# EAGLE design ETH_module (EAGLE 7.2.0)
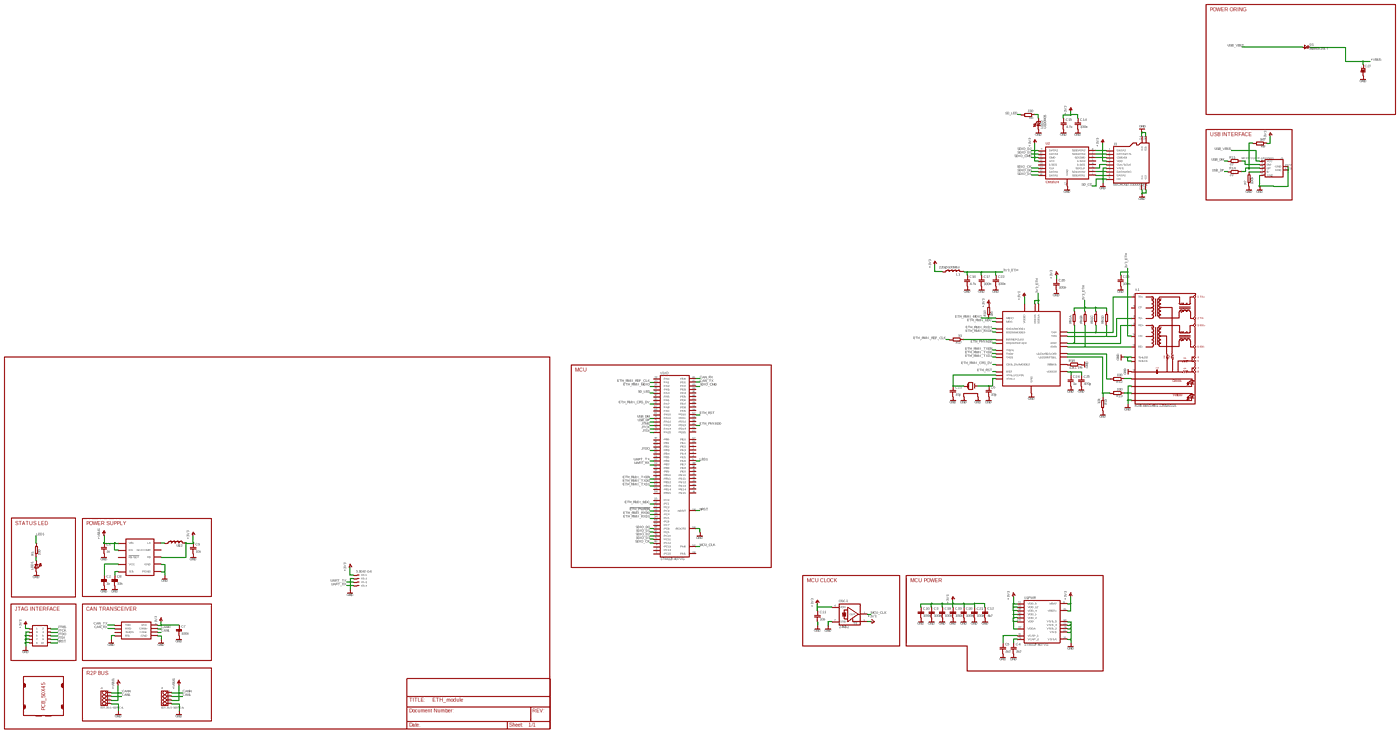
[diagram p0: schematic, sheet 1, overview]
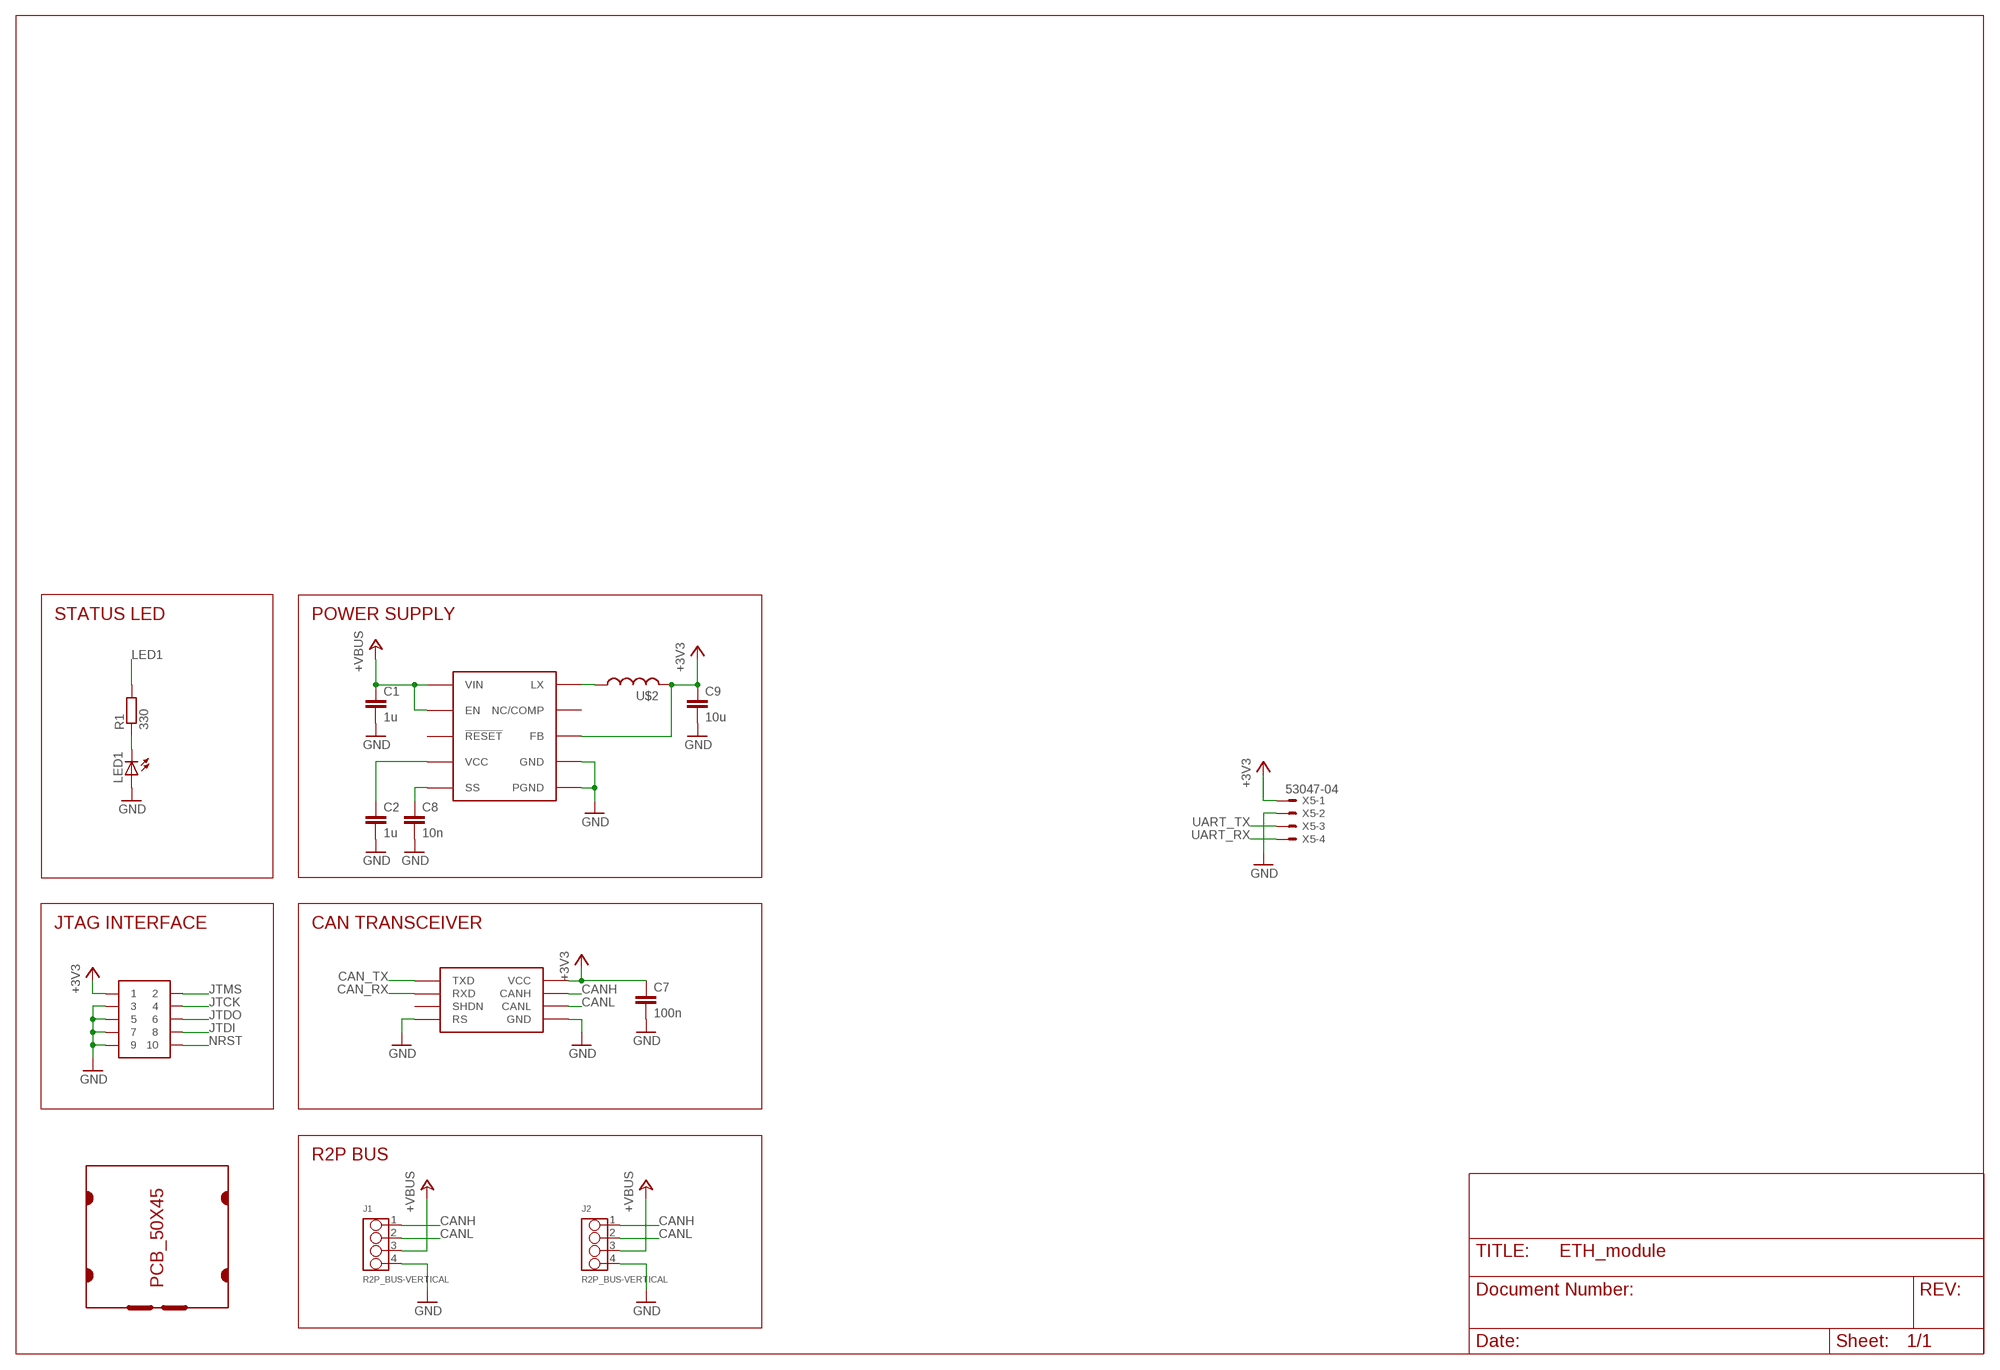
[diagram p1: schematic, sheet 1, part 1 of 4]
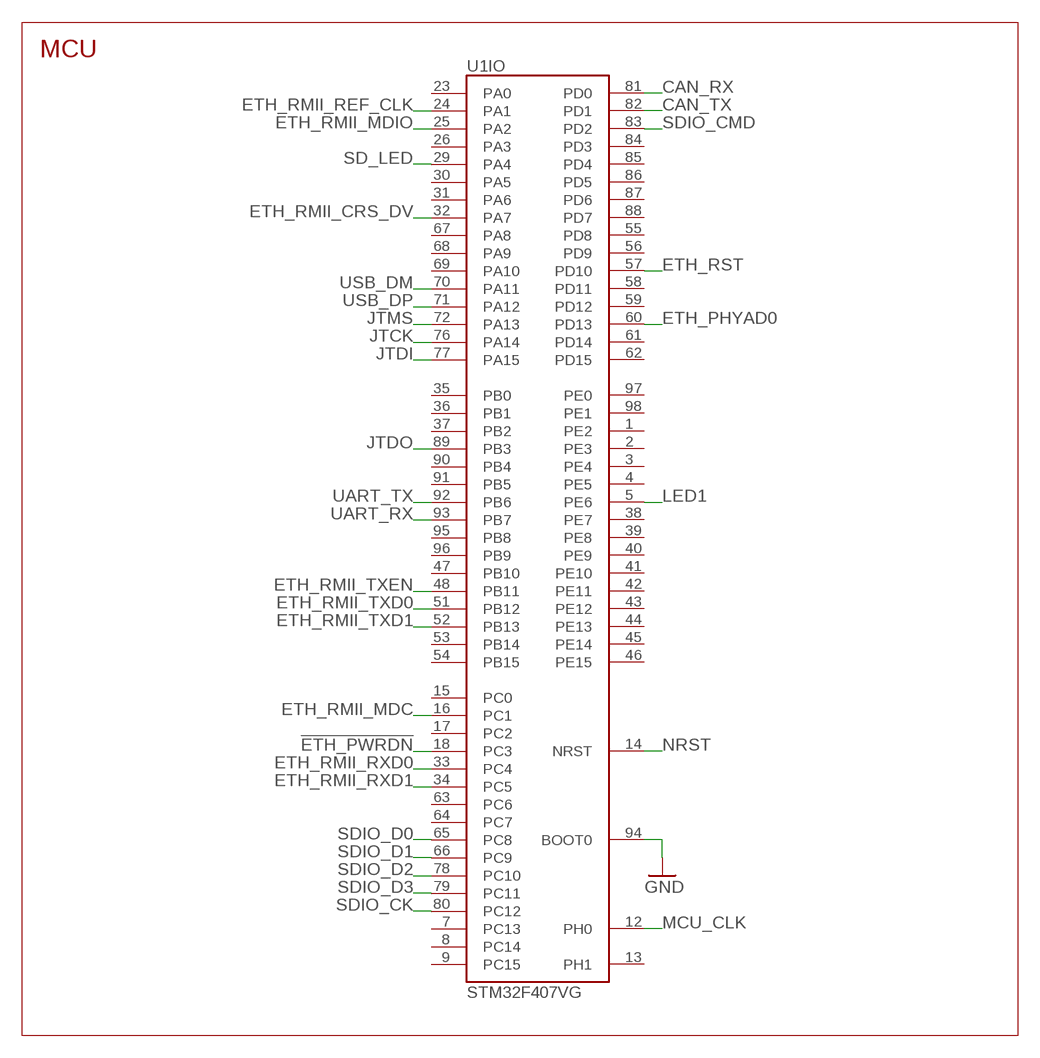
[diagram p2: schematic, sheet 1, part 2 of 4]
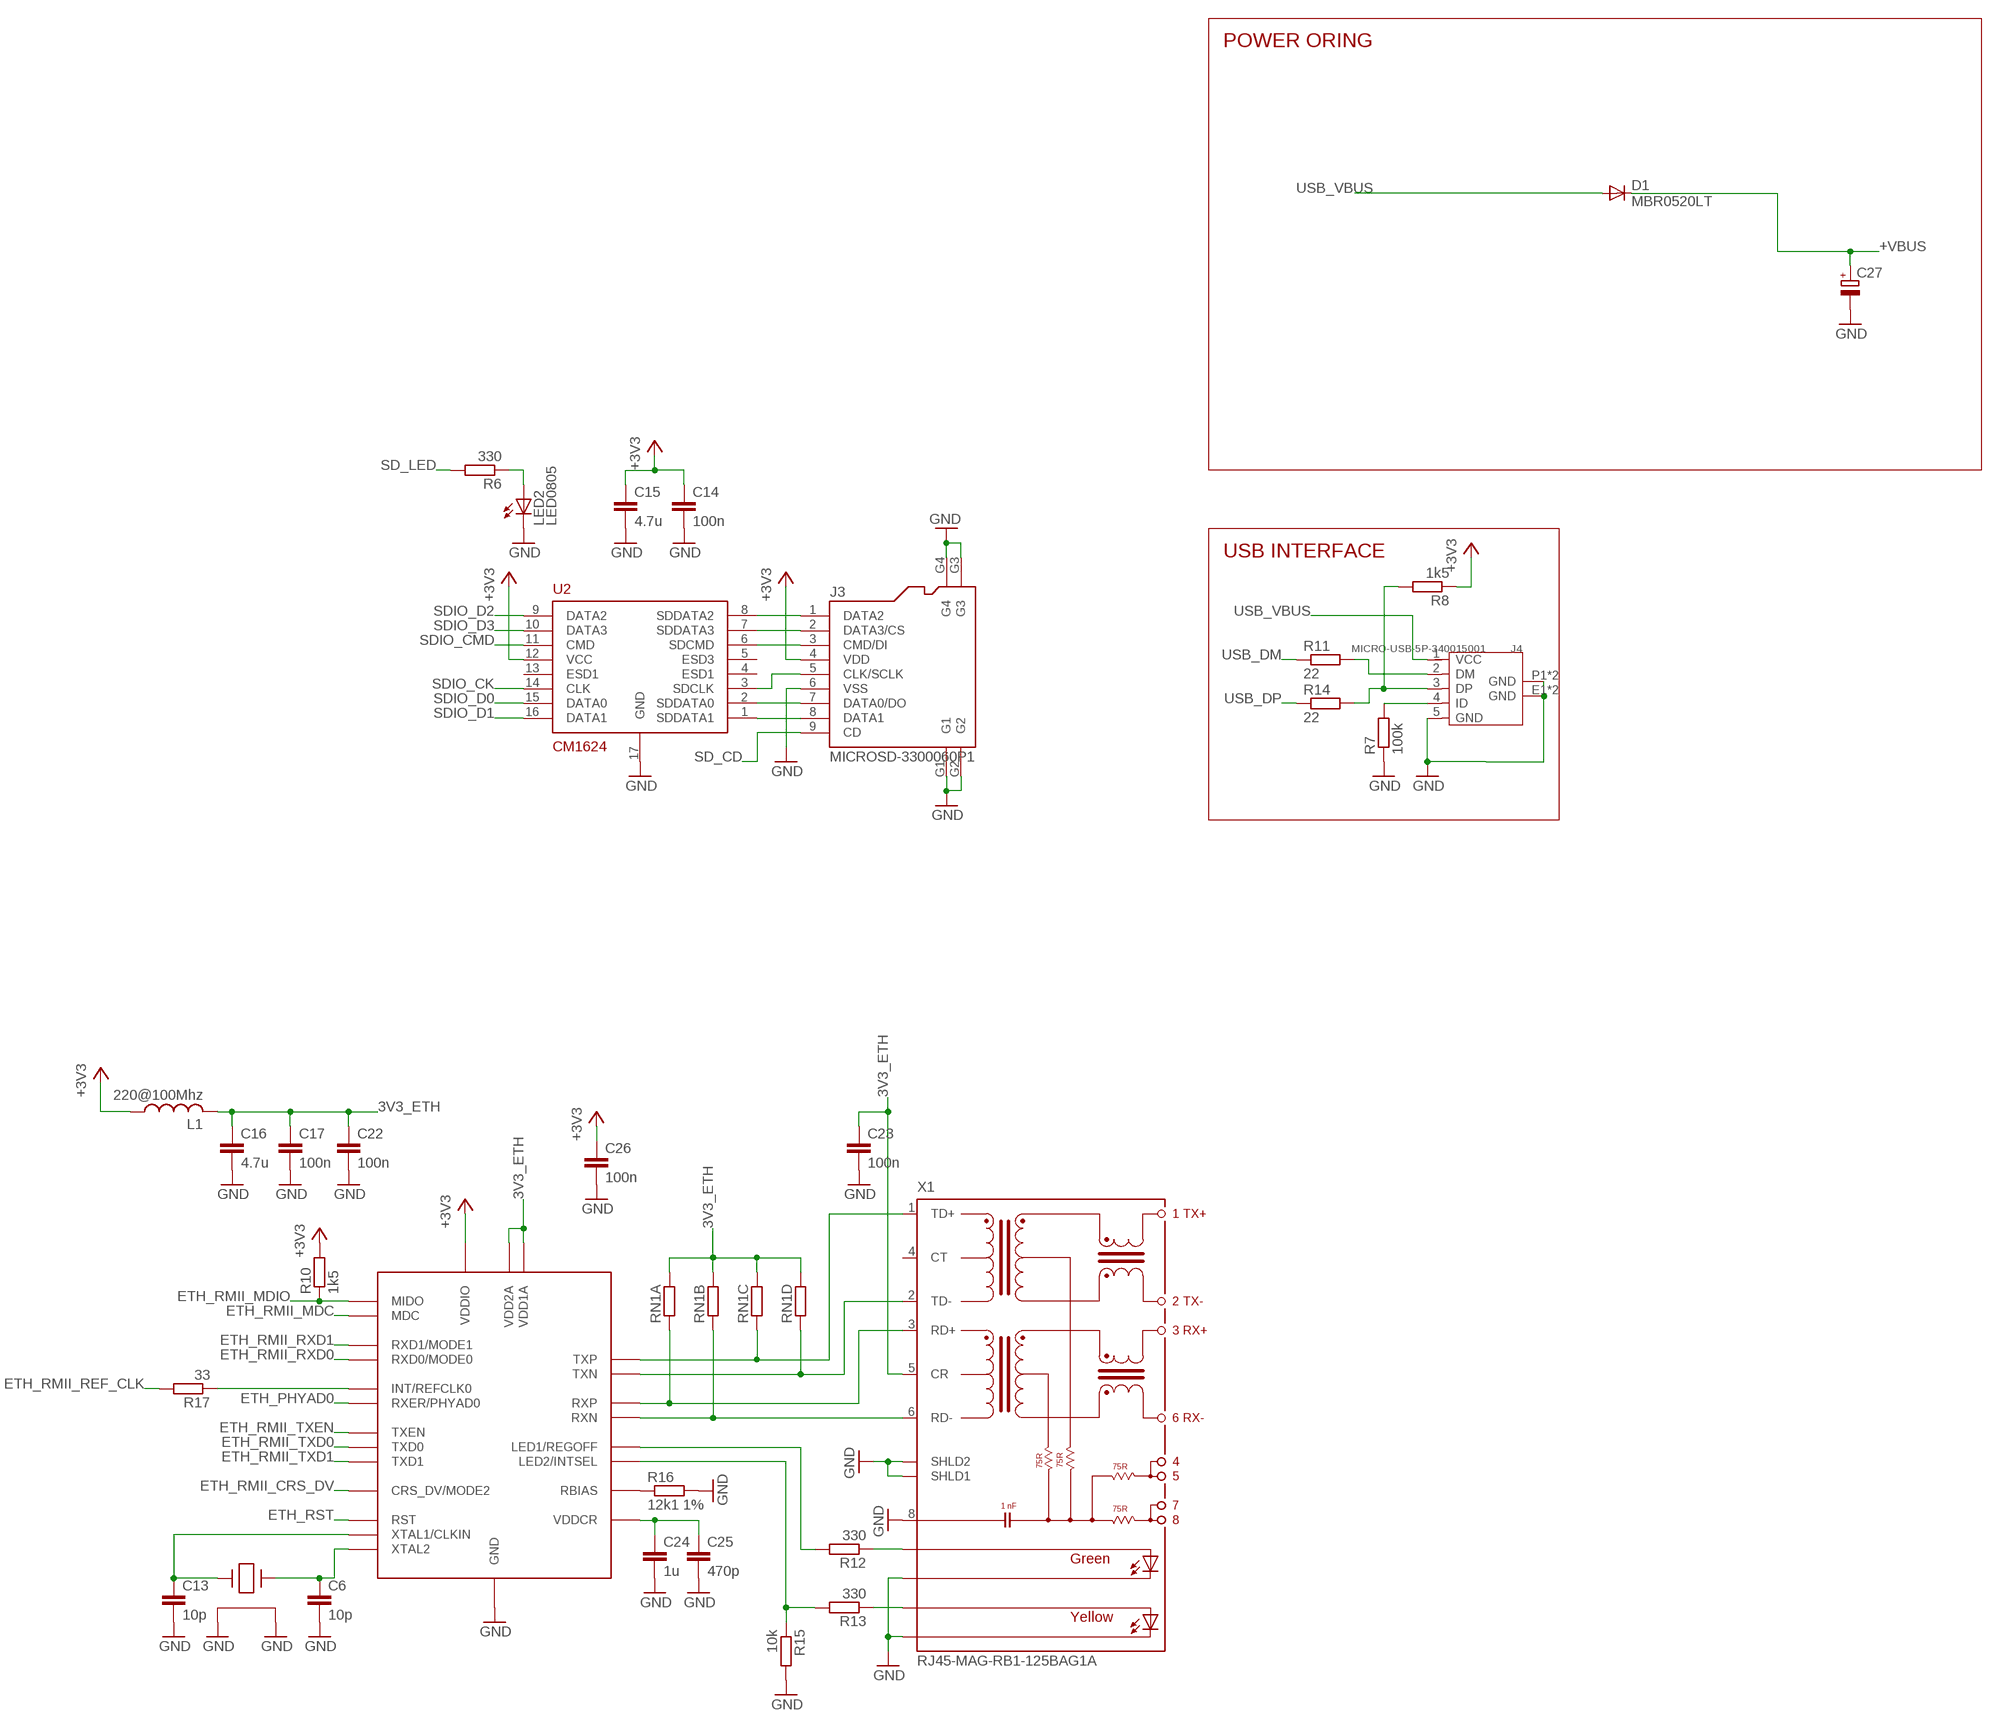
[diagram p3: schematic, sheet 1, part 3 of 4]
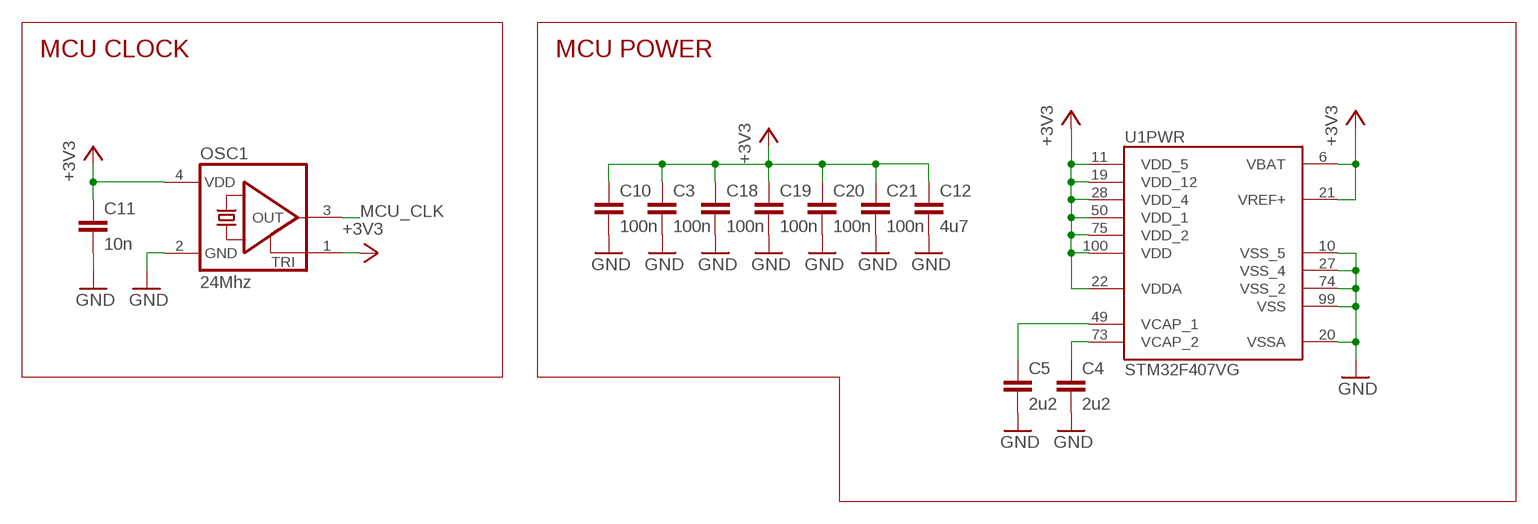
[diagram p4: schematic, sheet 1, part 4 of 4]

## Parts
C1  1u  C1206  [C1206]
C2  1u  C0603  [C0603]
C3  100n  C0603  [C0603]
C4  2u2  C0603  [C0603]
C5  2u2  C0603  [C0603]
C6  10p  C0603  [C0603]
C7  100n  C0603  [C0603]
C8  10n  C0603  [C0603]
C9  10u  C0805  [C0805]
C10  100n  C0603  [C0603]
C11  10n  C0603  [C0603]
C12  4u7  C0805  [C0805]
C13  10p  C0603  [C0603]
C14  100n  C0603  [C0603]
C15  4.7u  C0805  [C0805]
C16  4.7u  C0805  [C0805]
C17  100n  C0603  [C0603]
C18  100n  C0603  [C0603]
C19  100n  C0603  [C0603]
C20  100n  C0603  [C0603]
C21  100n  C0603  [C0603]
C22  100n  C0603  [C0603]
C23  100n  C0603  [C0603]
C24  1u  C0603  [C0603]
C25  470p  C0603  [C0603]
C26  100n  C0603  [C0603]
C27  CPOL-EUB/3528-21R  [B/3528-21R]
D1  MBR0520LT  [SOD123]
J1  R2P_BUS-VERTICAL  [OPL-EAGLE-LIBRARY_4P-2.0]
J2  R2P_BUS-VERTICAL  [OPL-EAGLE-LIBRARY_4P-2.0]
J3  MICROSD-3300060P1  [9P-SMD-W-RING]
J4  MICRO-USB-5P-340015001  [B-SMD-5P]
L1  220@100Mhz  L0603  [L0603]
LED1  LED0805  [CHIPLED_0805]
LED2  LED0805  [CHIPLED_0805]
OSC1  24Mhz  OSC  [XTAL_2.5X2]
R1  330  R0603  [R0603]
R6  330  R0603  [R0603]
R7  100k  R0603  [R0603]
R8  1k5  R0603  [R0603]
R10  1k5  R0603  [R0603]
R11  22  R0603  [R0603]
R12  330  R0603  [R0603]
R13  330  R0603  [R0603]
R14  22  R0603  [R0603]
R15  10k  R0603  [R0603]
R16  12k1 1%  R0603  [R0603]
R17  33  R0603  [R0603]
RN1  RNETWORK_4-1206  [RNET4_1206]
SOT1  MAX3051EKA  [SOT23-8L]
U1  STM32F407VG  [LQFP100]
U2  CM1624  [UDFN16]
U$1  PCB_50X45  [50X45]
U$2  LPS4018  [COILCRAFT_LPS4018]
U$3  MAX17501  [TDFN-10]
U$4  JTAG-TH  [SAMTEC_FTSH-105-TH]
U$5  LAN8720A  [QFN24]
U$6  XTAL-2.5X2  [XTAL_2.5X2]
X1  RJ45-MAG-RB1-125BAG1A  [WIZNET_RB1-125BAG1A]
X5  53047-04  [53047-04]

## Nets
3V3_ETH: C16.1 C17.1 C22.1 C23.1 L1.2 RN1.5 RN1.6 RN1.7 RN1.8 U$5.P$1(VDD2A) U$5.P$19(VDD1A) X1.5(CR)
!ETH_PWRDN: U1.18(IO:PC3)
+3V3: C3.1 C7.1 C9.1 C10.1 C11.1 C12.1 C14.1 C15.1 C18.1 C19.1 C20.1 C21.1 C26.1 J3.4(VDD) L1.1 OSC1.1(TRI) OSC1.4(VDD) R8.1 R10.2 SOT1.3(VCC) U1.6(PWR:VBAT) U1.11(PWR:VDD_5) U1.19(PWR:VDD_12) U1.21(PWR:VREF+) U1.22(PWR:VDDA) U1.28(PWR:VDD_4) U1.50(PWR:VDD_1) U1.75(PWR:VDD_2) U1.100(PWR:VDD) U2.12(VCC) U$2.P$2 U$3.P$5(FB) U$4.1 U$5.P$9(VDDIO) X5.1
+VBUS: C1.1 C27.+ D1.C J1.3 J2.3 U$3.P$2(VIN) U$3.P$3(EN)
CAN_RX: SOT1.4(RXD) U1.81(IO:PD0)
CAN_TX: SOT1.1(TXD) U1.82(IO:PD1)
CANH: J1.1 J2.1 SOT1.7(CANH)
CANL: J1.2 J2.2 SOT1.6(CANL)
ETH_PHYAD0: U1.60(IO:PD13) U$5.P$10(RXER/PHYAD0)
ETH_RMII_CRS_DV: U1.32(IO:PA7) U$5.P$11(CRS_DV/MODE2)
ETH_RMII_MDC: U1.16(IO:PC1) U$5.P$13(MDC)
ETH_RMII_MDIO: R10.1 U1.25(IO:PA2) U$5.P$12(MIDO)
ETH_RMII_REF_CLK: R17.2 U1.24(IO:PA1)
ETH_RMII_RXD0: U1.33(IO:PC4) U$5.P$8(RXD0/MODE0)
ETH_RMII_RXD1: U1.34(IO:PC5) U$5.P$7(RXD1/MODE1)
ETH_RMII_TXD0: U1.51(IO:PB12) U$5.P$17(TXD0)
ETH_RMII_TXD1: U1.52(IO:PB13) U$5.P$18(TXD1)
ETH_RMII_TXEN: U1.48(IO:PB11) U$5.P$16(TXEN)
ETH_RST: U1.57(IO:PD10) U$5.P$15(RST)
GND: C1.2 C2.2 C3.2 C4.2 C5.2 C6.2 C7.2 C8.2 C9.2 C10.2 C11.2 C12.2 C13.2 C14.2 C15.2 C16.2 C17.2 C18.2 C19.2 C20.2 C21.2 C22.2 C23.2 C24.2 C25.2 C26.2 C27.- J1.4 J2.4 J3.6(VSS) J3.G1 J3.G2 J3.G3 J3.G4 J4.5(GND) J4.E1(GND) J4.E2(GND) J4.P1(GND) J4.P2(GND) LED1.A LED2.C OSC1.2(GND) R7.1 R15.2 R16.2 SOT1.2(GND) SOT1.8(RS) U1.10(PWR:VSS_5) U1.20(PWR:VSSA) U1.27(PWR:VSS_4) U1.74(PWR:VSS_2) U1.94(IO:BOOT0) U1.99(PWR:VSS) U2.17(GND) U$3.P$1(PGND) U$3.P$9(GND) U$3.P$11(PGND) U$4.3 U$4.5 U$4.7 U$4.9 U$5.P$25(GND) U$6.2 U$6.4 X1.8 X1.9(SHLD1) X1.10(SHLD2) X1.L2(YK) X1.L4(GK) X5.2
JTCK: U1.76(IO:PA14) U$4.4
JTDI: U1.77(IO:PA15) U$4.8
JTDO: U1.89(IO:PB3) U$4.6
JTMS: U1.72(IO:PA13) U$4.2
LED1: R1.2 U1.5(IO:PE6)
MCU_CLK: OSC1.3(OUT) U1.12(IO:PH0)
N$1: U$2.P$1 U$3.P$10(LX)
N$4: LED1.C R1.1
N$6: LED2.A R6.1
N$7: C2.1 U$3.P$4(VCC)
N$8: C8.1 U$3.P$6(SS)
N$9: J4.2(DM) R11.2
N$10: J4.4(ID) R7.2
N$11: J3.1(DATA2) U2.8(SDDATA2)
N$12: J3.2(DATA3/CS) U2.7(SDDATA3)
N$13: J3.3(CMD/DI) U2.6(SDCMD)
N$14: J3.5(CLK/SCLK) U2.3(SDCLK)
N$15: R17.1 U$5.P$14(INT/REFCLK0)
N$16: J3.7(DATA0/DO) U2.2(SDDATA0)
N$17: J3.8(DATA1) U2.1(SDDATA1)
N$22: C13.1 U$5.P$5(XTAL1/CLKIN) U$6.1
N$23: C6.1 U$5.P$4(XTAL2) U$6.3
N$24: R12.2 U$5.P$3(LED1/REGOFF)
N$25: R12.1 X1.L3(GA)
N$26: R13.1 X1.L1(YA)
N$27: R13.2 R15.1 U$5.P$2(LED2/INTSEL)
N$28: C24.1 C25.1 U$5.P$6(VDDCR)
N$29: R16.1 U$5.P$24(RBIAS)
N$32: J4.3(DP) R8.2 R14.2
NRST: U1.14(IO:NRST) U$4.10
RX_N: RN1.2 U$5.P$22(RXN) X1.6(RD-)
RX_P: RN1.1 U$5.P$23(RXP) X1.3(RD+)
SD_CD: J3.9(CD)
SD_LED: R6.2 U1.29(IO:PA4)
SDIO_CK: U1.80(IO:PC12) U2.14(CLK)
SDIO_CMD: U1.83(IO:PD2) U2.11(CMD)
SDIO_D0: U1.65(IO:PC8) U2.15(DATA0)
SDIO_D1: U1.66(IO:PC9) U2.16(DATA1)
SDIO_D2: U1.78(IO:PC10) U2.9(DATA2)
SDIO_D3: U1.79(IO:PC11) U2.10(DATA3)
TX_N: RN1.4 U$5.P$20(TXN) X1.2(TD-)
TX_P: RN1.3 U$5.P$21(TXP) X1.1(TD+)
UART_RX: U1.93(IO:PB7) X5.4
UART_TX: U1.92(IO:PB6) X5.3
USB_DM: R11.1 U1.70(IO:PA11)
USB_DP: R14.1 U1.71(IO:PA12)
USB_VBUS: D1.A J4.1(VCC)
VCAP_1: C5.1 U1.49(PWR:VCAP_1)
VCAP_2: C4.1 U1.73(PWR:VCAP_2)
Unconnected: SOT1.5(SHDN) U1.1(IO:PE2) U1.2(IO:PE3) U1.3(IO:PE4) U1.4(IO:PE5) U1.7(IO:PC13) U1.8(IO:PC14) U1.9(IO:PC15) U1.13(IO:PH1) U1.15(IO:PC0) U1.17(IO:PC2) U1.23(IO:PA0) U1.26(IO:PA3) U1.30(IO:PA5) U1.31(IO:PA6) U1.35(IO:PB0) U1.36(IO:PB1) U1.37(IO:PB2) U1.38(IO:PE7) U1.39(IO:PE8) U1.40(IO:PE9) U1.41(IO:PE10) U1.42(IO:PE11) U1.43(IO:PE12) U1.44(IO:PE13) U1.45(IO:PE14) U1.46(IO:PE15) U1.47(IO:PB10) U1.53(IO:PB14) U1.54(IO:PB15) U1.55(IO:PD8) U1.56(IO:PD9) U1.58(IO:PD11) U1.59(IO:PD12) U1.61(IO:PD14) U1.62(IO:PD15) U1.63(IO:PC6) U1.64(IO:PC7) U1.67(IO:PA8) U1.68(IO:PA9) U1.69(IO:PA10) U1.84(IO:PD3) U1.85(IO:PD4) U1.86(IO:PD5) U1.87(IO:PD6) U1.88(IO:PD7) U1.90(IO:PB4) U1.91(IO:PB5) U1.95(IO:PB8) U1.96(IO:PB9) U1.97(IO:PE0) U1.98(IO:PE1) U2.4(ESD1) U2.5(ESD3) U2.13(ESD1) U$3.P$7(NC/COMP) U$3.P$8(!RESET) X1.4(CT)

## Notes on the sheet
- POWER ORING
- USB INTERFACE
- MCU
- STATUS LED | POWER SUPPLY
- MCU CLOCK | MCU POWER
- JTAG INTERFACE | CAN TRANSCEIVER
- R2P BUS

## Library data of the parts
C1-C26 = r2p_rcl:C
C27 = rcl:CPOL-EU: POLARIZED CAPACITOR, European symbol
D1 = diode:MBR0520LT: SCHOTTKY BARRIER RECTIFIER Source: http://onsemi.com .. MBR0520LT1-D.pdf
J1 J2 = r2p_connector:R2P_BUS
J3 = r2p_connector:MICROSD: Micro SD Card
J4 = OPL Eagle Library:MICRO-USB-5P: ST-USB-001E：MICRO USB B SMD R/A
L1 = r2p_rcl:L
LED1 LED2 = r2p_led:LED
OSC1 = r2p_ic:OSC
R1 R6-R8 R10-R17 = r2p_rcl:R
RN1 = r2p_rcl:RNETWORK_4: 4 Resistor Array 0603
SOT1 = r2p_ic:MAX3051
U1 = st:STM32F407VG
U2 = r2p_ic:CM1624
U$1 = r2p_pcb:PCB_50X45
U$2 = r2p_rcl:LPS4018
U$3 = r2p_ic:MAX17501
U$4 = r2p_connector:JTAG
U$5 = r2p_ic:LAN8720A
U$6 = r2p_ic:XTAL
X1 = r2p_connector:RJ45-MAG
X5 = con-molex:53?-04: CONNECTOR wire to board 1.25 mm (.049 inch) pitch header; MF: WALDOM/MOLEX; MPN: 53047-0410; OC_FARNELL: 9733060; OC_NEWARK: 38C9900

## Board
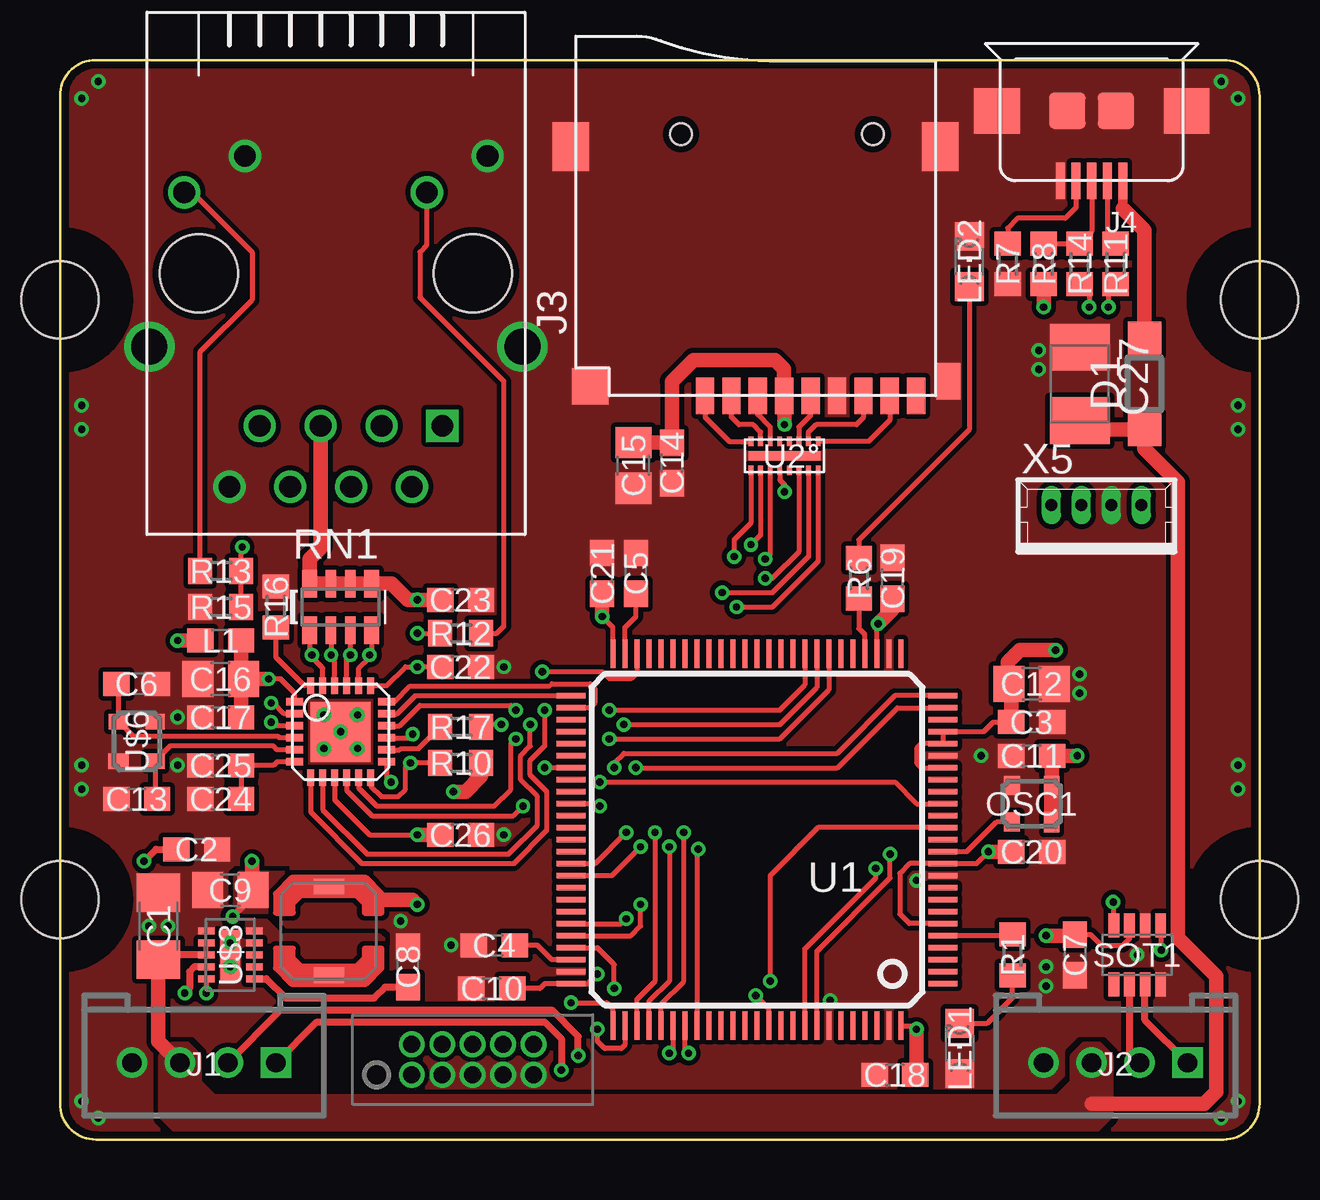
[diagram p5: board, top side]
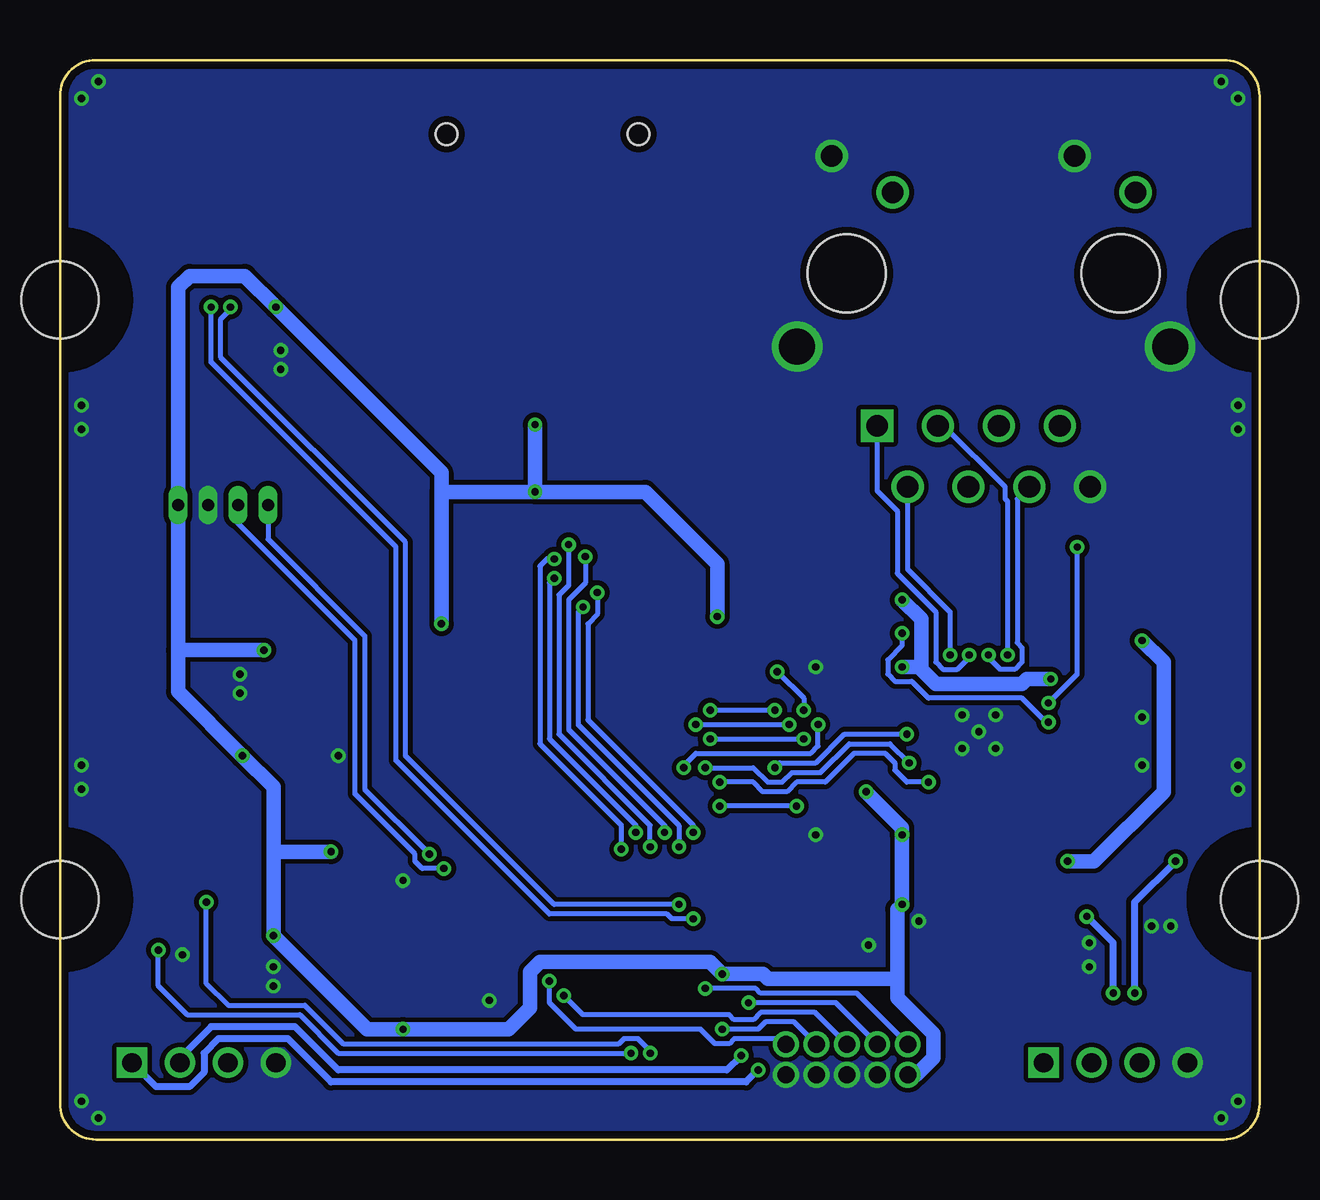
[diagram p6: board, bottom side, seen from below]

Size 50 x 45 mm. Coordinates in mm from the lower left corner, seen from the top.
Copper layers (1*16): Top 0.035mm / dielectric 1.5mm / Bottom 0.035mm
Design rules "2layer_0.2mm": minimum track width 0.2mm, minimum drill 0.3mm, track to track 0.2mm, track to pad 0.2mm, pad to pad 0.2mm, via to via 0.2mm, smd to smd 0mil, copper to edge 0.3mm, drill to drill 0.3mm, minimum pad ring 0.15mm, minimum via ring 0.15mm, stop-mask expansion 0.05mm, vias tented up to drill 2.5mm, thermal gap 0.25mm
tRestrict: 2 lines

### Footprints (pad centres in the part's own frame; a part is rotated, then mirrored left to right if it is on the bottom)
C1206 = smd 1.6 x 1.8: 1 -1.4,0; 2 1.4,0
C0603 = smd 1.1 x 1: 1 -0.85,0; 2 0.85,0
C0805 = smd 1.3 x 1.5: 1 -0.95,0; 2 0.95,0
B/3528-21R = smd 1.95 x 2.5: + 1.525,0; - -1.525,0
SOD123 = smd 1.4 x 1.4: A 1.9,0; C -1.9,0
OPL-EAGLE-LIBRARY_4P-2.0 = drill 0.8 pad 1.27 square: 1 -3,0 | drill 0.8 pad 1.27: 2 -1,0; 3 1,0; 4 3,0
9P-SMD-W-RING = smd 1.524 x 0.762: 1 -7.493,2.114; 2 -7.493,1.014; 3 -7.493,-0.086; 4 -7.493,-1.186; 5 -7.493,-2.286; 6 -7.493,-3.386; 7 -7.493,-4.486; 8 -7.493,-5.586; 9 -7.493,-6.686 | smd 1.524 x 1.016: G1 -6.893,-8.032 | smd 2.032 x 1.524: G2 2.88,-7.686; G3 2.88,7.714 | smd 1.524 x 1.524: G4 -7.101,6.895 | hole 0.889: 3.407,-4.886; 3.407,3.114
B-SMD-5P = smd 0.38 x 1.52: 1 -1.3,2.54; 2 -0.65,2.54; 3 0,2.54; 4 0.65,2.54; 5 1.3,2.54 | smd 1.524 x 1.524: E1 -1.016,-0.381; E2 1.016,-0.381 | smd 1.9 x 1.9: P1 -3.95,-0.381; P2 3.95,-0.381
L0603 = smd 1.1 x 1: 1 -0.85,0; 2 0.85,0
CHIPLED_0805 = smd 1.2 x 1.2: A 0,-1.05; C 0,1.05
XTAL_2.5X2 = smd 0.65 x 0.8: 1 -0.825,-0.762; 2 0.825,-0.762; 3 0.825,0.762 | smd 0.65 x 0.85: 4 -0.825,0.762
R0603 = smd 1 x 1.1: 1 -0.85,0; 2 0.85,0
RNET4_1206 = smd 0.63 x 1.15: 1 -1.295,-0.975; 4 1.295,-0.975; 5 1.295,0.975; 8 -1.295,0.975 | smd 0.44 x 1.15: 2 -0.4,-0.975; 3 0.4,-0.975; 6 0.4,0.975; 7 -0.4,0.975
SOT23-8L = smd 0.45 x 1: 1 -0.975,-1.225; 2 -0.325,-1.225; 3 0.325,-1.225; 4 0.975,-1.225; 5 0.975,1.225; 6 0.325,1.225; 7 -0.325,1.225; 8 -0.975,1.225
LQFP100 = smd 1.2 x 0.22: 1 -7.302,6.099; 2 -7.302,5.599; 3 -7.302,5.099; 4 -7.302,4.599; 5 -7.302,4.099; 6 -7.302,3.599; 7 -7.302,3.099; 8 -7.302,2.599; 9 -7.302,2.099; 10 -7.302,1.599; 11 -7.302,1.099; 12 -7.302,0.599; 13 -7.302,0.099; 14 -7.302,-0.401; 15 -7.302,-0.901; 16 -7.302,-1.401; 17 -7.302,-1.901; 18 -7.302,-2.401; 19 -7.302,-2.901; 20 -7.302,-3.401; 21 -7.302,-3.901; 22 -7.302,-4.401; 23 -7.302,-4.901; 24 -7.302,-5.401; 25 -7.302,-5.901; 51 8.202,-5.899; 52 8.202,-5.399; 53 8.202,-4.899; 54 8.202,-4.399; 55 8.202,-3.899; 56 8.202,-3.399; 57 8.202,-2.899; 58 8.202,-2.399; 59 8.202,-1.899; 60 8.202,-1.399; 61 8.202,-0.899; 62 8.202,-0.399; 63 8.202,0.101; 64 8.202,0.601; 65 8.202,1.101; 66 8.202,1.601; 67 8.202,2.101; 68 8.202,2.601; 69 8.202,3.101; 70 8.202,3.601; 71 8.202,4.101; 72 8.202,4.601; 73 8.202,5.101; 74 8.202,5.601; 75 8.202,6.101 | smd 0.22 x 1.2: 26 -5.549,-7.652; 27 -5.049,-7.652; 28 -4.549,-7.652; 29 -4.049,-7.652; 30 -3.549,-7.652; 31 -3.049,-7.652; 32 -2.549,-7.652; 33 -2.049,-7.652; 34 -1.549,-7.652; 35 -1.049,-7.652; 36 -0.549,-7.652; 37 -0.049,-7.652; 38 0.451,-7.652; 39 0.951,-7.652; 40 1.451,-7.652; 41 1.951,-7.652; 42 2.451,-7.652; 43 2.951,-7.652; 44 3.451,-7.652; 45 3.951,-7.652; 46 4.451,-7.652; 47 4.951,-7.652; 48 5.451,-7.652; 49 5.951,-7.652; 50 6.451,-7.652; 76 6.449,7.852; 77 5.949,7.852; 78 5.449,7.852; 79 4.949,7.852; 80 4.449,7.852; 81 3.949,7.852; 82 3.449,7.852; 83 2.949,7.852; 84 2.449,7.852; 85 1.949,7.852; 86 1.449,7.852; 87 0.949,7.852; 88 0.449,7.852; 89 -0.051,7.852; 90 -0.551,7.852; 91 -1.051,7.852; 92 -1.551,7.852; 93 -2.051,7.852; 94 -2.551,7.852; 95 -3.051,7.852; 96 -3.551,7.852; 97 -4.051,7.852; 98 -4.551,7.852; 99 -5.051,7.852; 100 -5.551,7.852
UDFN16 = smd 0.2 x 0.4: 1 -1.4,-0.6; 2 -1,-0.6; 3 -0.6,-0.6; 4 -0.2,-0.6; 5 0.2,-0.6; 6 0.6,-0.6; 7 1,-0.6; 8 1.4,-0.6; 9 1.4,0.6; 10 1,0.6; 11 0.6,0.6; 12 0.2,0.6; 13 -0.2,0.6; 14 -0.6,0.6; 15 -1,0.6; 16 -1.4,0.6 | smd 3 x 0.4: 17 0,0
50X45 = hole 3.2: 0,10; 50,10; 0,35; 50,35
COILCRAFT_LPS4018 = smd 0.635 x 1.27: P$1 -1.85,0; P$2 1.85,0
TDFN-10 = smd 0.7 x 0.3: P$1 -1,1; P$2 -1,0.5; P$3 -1,0; P$4 -1,-0.5; P$5 -1,-1; P$6 1,-1; P$7 1,-0.5; P$8 1,0; P$9 1,0.5; P$10 1,1 | smd 0.8 x 2.08: P$11 0,0
SAMTEC_FTSH-105-TH = drill 0.711 pad 1.016: 1 -2.54,0; 2 -2.54,1.27; 3 -1.27,0; 4 -1.27,1.27; 5 0,0; 6 0,1.27; 7 1.27,0; 8 1.27,1.27; 9 2.54,0; 10 2.54,1.27
QFN24 = smd 0.7 x 0.3: P$1 -1.92,1.25; P$2 -1.92,0.75; P$3 -1.92,0.25; P$4 -1.92,-0.25; P$5 -1.92,-0.75; P$6 -1.92,-1.25; P$13 1.92,-1.25; P$14 1.92,-0.75; P$15 1.92,-0.25; P$16 1.92,0.25; P$17 1.92,0.75; P$18 1.92,1.25 | smd 0.3 x 0.7: P$7 -1.25,-1.92; P$8 -0.75,-1.92; P$9 -0.25,-1.92; P$10 0.25,-1.92; P$11 0.75,-1.92; P$12 1.25,-1.92; P$19 1.25,1.92; P$20 0.75,1.92; P$21 0.25,1.92; P$22 -0.25,1.92; P$23 -0.75,1.92; P$24 -1.25,1.92 | smd 2.5 x 2.5: P$25 0,0
WIZNET_RB1-125BAG1A = drill 0.9 square: 1 -4.444,6.35 | drill 0.9: 2 -3.175,8.89; 3 -1.905,6.35; 4 -0.634,8.89; 5 0.635,6.35; 6 1.905,8.89; 7 3.175,6.35; 8 4.446,8.89; L1 6.325,-3.38; L2 3.785,-4.9; L3 -3.785,-3.38; L4 -6.325,-4.9 | drill 1.5: 9 -7.775,3.05; 10 7.775,3.05 | hole 3.25: -5.715,0; 5.715,0
53047-04 = drill 0.5 pad 0.698 long: 1 1.875,0.45; 2 0.625,0.45; 3 -0.625,0.45; 4 -1.875,0.45

### Placement (x,y rotation side)
C1  4.1,8.9 90 top
C2  5.7,12.1 0 top
C3  40.5,17.4 0 top
C4  18.1,8.1 180 top
C5  24,23.6 90 top
C6  3.2,19 0 top
C7  42.3,7.7 270 top
C8  14.5,7.2 90 top
C9  7.1,10.4 180 top
C10  18,6.3 180 top
C11  40.5,16 180 top
C12  40.5,19 0 top
C13  3.2,14.2 180 top
C14  25.5,28.2 270 top
C15  23.9,28.1 270 top
C16  6.7,19.2 180 top
C17  6.7,17.6 180 top
C18  34.8,2.7 180 top
C19  34.7,23.4 90 top
C20  40.5,12 0 top
C21  22.6,23.6 90 top
C22  16.7,19.7 0 top
C23  16.7,22.5 0 top
C24  6.7,14.2 180 top
C25  6.7,15.6 180 top
C26  16.7,12.7 0 top
C27  42.5,31.5 270 top
D1  45.2,31.5 90 top
J1  6,3.2 180 top
J2  44,3.2 180 top
J3  29,38.5 90 top
J4  43,42.5 180 top
L1  6.7,20.8 0 top
LED1  37.5,3.8 0 top
LED2  37.9,36.6 0 top
OSC1  40.5,14 180 top
R1  39.7,7.7 90 top
R6  33.3,23.4 270 top
R7  39.5,36.5 90 top
R8  41,36.5 90 top
R10  16.7,15.7 0 top
R11  44,36.5 90 top
R12  16.7,21.1 180 top
R13  6.7,23.7 0 top
R14  42.5,36.5 90 top
R15  6.7,22.2 180 top
R16  9,22.2 90 top
R17  16.7,17.2 0 top
RN1  11.7,22.2 0 top
SOT1  44.9,7.7 180 top
U1  29.5,12.6 180 top
U2  30.2,28.5 180 top
U$1  0,0 0 top
U$2  11.2,8.7 90 top
U$3  7.1,7.7 0 top
U$4  17.2,2.7 0 top
U$5  11.7,17 0 top
U$6  3.2,16.6 90 top
X1  11.5,36.1 180 top
X5  43.2,26 0 top

### Tracks (layer width: path | path; a pad name or v marks a point on that pad's centre or on a via)
3V3_ETH  (via drill 0.3)
  Top 0.2: 7.55,19.3 C16.1 | RN1.8 | U$5.P$1 9.78,18.62 9.2,19.2 v8.7,19.2 | U$5.P$19 13.62,18.92 14.4,19.7 v14.9,19.7 C22.1
  Top 0.6: C17.1 7.55,19.1 C16.1 v8.7,19.2 | L1.2 7.55,19.3 | RN1.8 RN1.7 RN1.6 RN1.5 13.82,23.18 14.5,22.5 v14.9,22.5 C23.1 | X1.5 10.86,24.66 10.4,24.2 RN1.8
  Bottom 0.6: v14.9,22.5 14.1,21.7 14.1,19.6 | v8.7,19.2 9.7,19.2 9.9,19 13.5,19 14.1,19.6 | v14.9,19.7 14.2,19.7 14.1,19.6
+3V3  (via drill 0.3)
  Top 0.2: U$3.P$5 v6.1,6.1 | C7.1 42.95,8.55 43.4,8.1 44.3,8.1 44.58,8.38 SOT1.3 | U1.50 23.05,21.35 v22.6,21.8 | C10.1 20,6.3 20.2,6.5 U1.75 22,6.5 v22.4,6.9 | v38.7,12 38.2,11.5 U1.11 35.4,11.5 35,11.1 35,9.4 35.4,9 U1.6 | 41.35,14.79 OSC1.1 | C3.1 38.9,17.4 38.5,17 U1.22 U1.21 35.9,16.5 35.7,16.3 35.7,15.7 35.9,15.5 U1.19 | 39.65,18.9 C12.1 | U$5.P$9 11.45,14.15 12.9,12.7 v14.9,12.7 | U2.12 30,27.5 30.2,27.3 v30.2,27 | U1.100 35.55,4.75 v35.7,4.6 | U1.28 34.05,21.45 v34.1,21.5
  Top 0.3: 8.05,10.55 8.05,10.75 7.95,10.75 | v7.2,9.3 8.05,10.15 C9.1
  Top 0.6: 8.2,10.55 C9.1 8,10.45 v8,11.6 | v41.1,8.5 42.25,8.5 C7.1 | v22.6,21.8 C21.1 | C20.1 v38.7,12 | OSC1.1 OSC1.4 | 41.35,14.79 C11.1 v42.4,16 | C3.1 39.65,18.9 | C12.1 39.5,19.05 39.5,19.9 40,20.4 v41.5,20.4 | v14.9,9.8 14.7,10 13,10 | C26.1 v14.9,12.7 | L1.1 v4.9,20.8 | v30.2,29.8 30.2,30.99 J3.4 30.19,32.11 29.8,32.5 26.4,32.5 25.5,31.6 C14.1 C15.1 | R8.1 v41,34.7 | R10.2 17.55,15.15 16.9,14.5 v16.4,14.5 | C18.1 35.7,2.75 v35.7,4.6 | C19.1 34.7,22.1 v34.1,21.5
  Bottom 0.3: v6.1,6.1 6.1,8.2 v7.2,9.3
  Bottom 0.6: U$4.1 14.3,2.7 13.6,3.4 13.6,4.4 15.1,5.9 15.1,6.7 | 15.1,6.7 15.1,9.6 v14.9,9.8 v14.9,12.7 14.9,13 v16.4,14.5 | 15.1,6.7 20.5,6.7 20.7,6.9 v22.4,6.9 22.9,7.4 30,7.4 30.4,7 30.4,5.5 31.3,4.6 v35.7,4.6 37.2,4.6 v41.1,8.5 41.1,12 | 41.1,12 41.1,14.7 v42.4,16 45.08,18.68 45.08,20.4 | v4.9,20.8 4,19.9 4,14.5 6.9,11.6 v8,11.6 | v30.2,27 25.6,27 22.6,24 v22.6,21.8 | v34.1,21.5 34.1,27 | v30.2,29.8 v30.2,27 | v30.2,27 34.1,27 | 34.1,27 34.1,27.8 v41,34.7 42.3,36 44.6,36 45.08,35.52 X5.1 45.08,20.4 | v38.7,12 41.1,12 | v41.5,20.4 45.08,20.4
  pour Top (rank 5, no thermals): 13.3,8.9 13.5,9.1 13.5,10.3 12.8,11 9.5,11 9.4,11.1 7.5,11.1 7.3,10.9 7.3,9.8 8.3,8.9
+VBUS
  Top 0.2: U$3.P$3 U$3.P$2
  Top 0.3: U$3.P$3 4.3,7.7 C1.1
  Top 0.6: C1.1 4.1,4.1 J1.3 | C27.+ 42.88,29.6 D1.C 45.2,28.8 46.6,27.4 46.6,8.4 48.2,6.8 48.2,2 47.7,1.5 43,1.5
  pour Top (no thermals): 4.7,4 5.3,4 5.8,3.5 5.8,2.4 6.4,1.8 41.6,1.8 42.2,2.4 42.2,3.5 42.7,4 43.3,4 43.8,3.5 43.8,1 42.8,0 5.2,0 4.2,1 4.2,3.5
CAN_RX  (via drill 0.3)
  Top 0.2: SOT1.4 43.92,9.88 v43.9,9.9 | U1.81 25.55,3.75 v25.4,3.6
  Bottom 0.2: v43.9,9.9 43.9,6.5 43,5.6 39.8,5.6 38.2,4 26.7,4 26.5,4.2 25.9,4.2 25.4,3.7 v25.4,3.6
CAN_TX  (via drill 0.3)
  Top 0.2: SOT1.1 45.88,7.92 v45.9,7.9 | v26.2,3.6 26.05,3.75 U1.82
  Bottom 0.2: v45.9,7.9 45.9,6.4 44.7,5.2 40,5.2 38.4,3.6 v26.2,3.6
CANH  (via drill 0.3)
  Top 0.3: J2.1 45.23,4.97 SOT1.7 | J1.1 10.7,4.9 20.2,4.9 20.9,4.2 v20.9,2.9
  Bottom 0.3: J2.1 46,2.2 44.6,2.2 44,2.8 44,3.6 43.4,4.2 40.5,4.2 38.7,2.4 21.4,2.4 v20.9,2.9
CANL  (via drill 0.3 pad 0.61)
  Top 0.3: SOT1.6 44.58,3.62 J2.2 | J1.2 9.2,5.4 20.5,5.4 21.6,4.3 v21.6,3.5
  Bottom 0.3: J2.2 45,3.4 43.7,4.7 40.2,4.7 38.4,2.9 22.2,2.9 v21.6,3.5
ETH_PHYAD0  (via drill 0.3)
  Top 0.2: U$5.P$10 11.95,14.55 13,13.5 18.9,13.5 v19.3,13.9 | v22.5,13.9 22.4,14 U1.60
  Bottom 0.2: v19.3,13.9 v22.5,13.9
ETH_RMII_CRS_DV  (via drill 0.3)
  Top 0.2: U$5.P$11 12.45,14.65 13.2,13.9 18.1,13.9 18.8,14.6 18.8,16.5 v19,16.7 | v22.9,16.7 30,16.7 32.05,18.75 U1.32
  Bottom 0.2: v22.9,16.7 v19,16.7
ETH_RMII_MDC  (via drill 0.3)
  Top 0.2: v22.5,14.9 34.8,14.9 35.7,14 U1.16 | U$5.P$13 13.62,15.08 v13.8,14.9
  Bottom 0.2: v22.5,14.9 21.1,14.9 20.7,14.5 19.7,14.5 19.3,14.9 18.1,14.9 16.9,16.1 15.6,16.1 15.2,15.7 15.2,15.4 14.7,14.9 v13.8,14.9
ETH_RMII_MDIO  (via drill 0.3)
  Top 0.2: 15.75,15.7 R10.1 v14.6,15.7 14.4,15.5 14.4,14.6 14.1,14.3 13.4,14.3 12.95,14.75 U$5.P$12 12.97,15.1 | v23.1,15.5 23.1,15.7 23.5,16.1 32.4,16.1 34.8,18.5 U1.25
  Bottom 0.2: v23.1,15.5 21.1,15.5 20.5,14.9 19.9,14.9 19.5,15.3 18.3,15.3 17.1,16.5 15.4,16.5 v14.6,15.7
ETH_RMII_REF_CLK  (via drill 0.3)
  Top 0.2: v18.4,17.3 17.65,17.3 R17.2 | v24,15.5 32.4,15.5 34.9,18 U1.24
  Bottom 0.2: v18.4,17.3 18.4,16.4 18.7,16.1 23.5,16.1 24,15.6 v24,15.5
ETH_RMII_RXD0  (via drill 0.3)
  Top 0.2: U$5.P$8 10.95,13.75 12.8,11.9 18.7,11.9 19.9,13.1 19.9,14.3 19.2,15 19.2,16 19.6,16.4 v19.6,17.3 | v23.5,17.3 30,17.3 31.55,18.85 U1.33
  Bottom 0.2: v23.5,17.3 v19.6,17.3
ETH_RMII_RXD1  (via drill 0.3)
  Top 0.2: U$5.P$7 10.45,13.65 12.6,11.5 18.9,11.5 20.3,12.9 20.3,14.5 19.6,15.2 19.6,15.8 20.2,16.4 v20.2,17.9 | v22.9,17.9 30,17.9 31.05,18.95 U1.34
  Bottom 0.2: v22.9,17.9 v20.2,17.9
ETH_RMII_TXD0
  Top 0.2: U$5.P$17 14.05,17.75 14.8,18.5 U1.51
ETH_RMII_TXD1
  Top 0.2: U$5.P$18 13.95,18.25 14.6,18.9 20.4,18.9 20.5,19 22.1,19 22.3,18.8 22.3,18.2 22.1,18 U1.52
ETH_RMII_TXEN  (via drill 0.3)
  Top 0.2: U$5.P$16 14.15,17.25 15,18.1 18.8,18.1 v19,17.9 | U1.48 24.05,19.45 23.8,19.2 22.9,19.2 22.6,19.5 v20.1,19.5
  Bottom 0.2: v20.1,19.5 19,18.4 v19,17.9
ETH_RST  (via drill 0.3)
  Top 0.2: U$5.P$15 14.55,16.75 v14.7,16.9 | U1.57 v20.2,15.5
  Bottom 0.2: v20.2,15.5 20,15.7 18.5,15.7 17.3,16.9 v14.7,16.9
GND  (via drill 0.3)
  other vias: 7.1,8.2 7.1,7.2 4.5,8.9 3.7,8.9 41.1,6.4 41.1,7.2 44.9,7.7 49.1,1.6 48.4,0.9 1.6,0.9 0.9,1.6 14.2,9.1 11.7,17 12.4,17.7 12.4,16.3 11,16.3 11,17.7 18.5,19.7 4.9,17.6 4.9,15.6 18.5,12.7 16.3,8.1 32.1,5.8 35.7,10.8 49.1,14.6 49.1,15.6 49.1,30.6 49.1,29.6 0.9,15.6 0.9,14.6 0.9,30.6 0.9,29.6 42.5,19.4 42.5,18.6 38.4,16 40.8,32.9 40.8,32.1 49.1,43.4 48.4,44.1 0.9,43.4 1.6,44.1
  pour Bottom (no thermals): 0,0 50,0 50,45 0,45
  pour Top (rank 6, no thermals): 0,0 50,0 50,45 0,45
JTCK  (via drill 0.3)
  Top 0.2: v21.3,5.7 22.8,5.7 23.05,5.45 U1.76
  Bottom 0.2: U$4.4 17.66,5.7 v21.3,5.7
JTDI  (via drill 0.3)
  Top 0.2: U1.77 23.55,3.95 23.4,3.8 22.7,3.8 22.4,4.1 v22.4,4.6
  Bottom 0.2: U$4.8 19.4,4.9 20.6,4.9 20.9,4.6 v22.4,4.6
JTDO  (via drill 0.3)
  Top 0.2: U1.89 29.55,5.45 v29,6
  Bottom 0.2: U$4.6 18.53,5.3 20.8,5.3 21.1,5 21.9,5 22.1,5.2 28.2,5.2 v29,6
JTMS  (via drill 0.3)
  Top 0.2: U1.72 22.4,8 23.1,7.3 v23.1,6.3
  Bottom 0.2: U$4.2 16.79,6.1 20.8,6.1 21,6.3 v23.1,6.3
LED1
  Top 0.2: U1.5 39.65,8.5 R1.2
MCU_CLK
  Top 0.2: U1.12 37.8,12 39.04,13.24 OSC1.3
N$1
  pour Top (no thermals): 7.8,8.7 8.2,8.7 8.5,8.2 8.5,7.5 9.6,6.4 12.8,6.4 13.5,7.1 13.5,8.3 13.3,8.5 9.2,8.5 8.6,9.1 7.8,9.1
N$4
  Top 0.2: LED1.C 38.65,4.85 39.7,5.9 R1.1
N$6
  Top 0.2: LED2.A 37.9,29.6 33.3,25 R6.1
N$7  (via drill 0.3)
  Top 0.3: U$3.P$4 5.6,7.2 5.4,7 5.4,6.3 v5.2,6.1 | v3.5,11.6 4,12.1 C2.1
  Bottom 0.3: v5.2,6.1 5.2,9.9 v3.5,11.6
N$8
  Top 0.3: U$3.P$6 8.6,6.7 9.4,5.9 13.1,5.9 13.55,6.35 C8.1
N$9
  Top 0.2: J4.2 43.65,37.7 R11.2
N$10
  Top 0.2: J4.4 42.35,38.85 41.9,38.4 39.9,38.4 39.5,38 R7.2
N$11
  Top 0.2: J3.1 26.89,30.11 27.9,29.1 U2.8
N$12
  Top 0.2: U2.7 29.2,29.5 28.9,29.8 28.3,29.8 27.99,30.11 J3.2
N$13
  Top 0.2: J3.3 29.09,30.21 29.6,29.7 U2.6
N$14
  Top 0.2: J3.5 31.29,30.19 30.8,29.7 U2.3
N$15
  Top 0.2: U$5.P$14 14.15,16.25 14.2,16.3 14.95,16.3 R17.1
N$16
  Top 0.2: J3.7 33.49,30.09 33.2,29.8 31.5,29.8 31.2,29.5 U2.2
N$17
  Top 0.2: J3.8 34.59,29.99 33.7,29.1 U2.1
N$22
  Top 0.2: U$5.P$5 9.05,16.25 8.9,16.4 4.59,16.4 U$6.1 3.96,14.29 C13.1
N$23
  Top 0.2: U$5.P$4 9.15,16.75 9.1,16.8 3.06,16.8 U$6.3 2.44,18.91 C6.1
N$24  (via drill 0.3)
  Top 0.2: U$5.P$3 8.95,17.25 v8.8,17.4 | v14.9,21.1 R12.2
  Bottom 0.2: v8.8,17.4 8.9,17.4 9.9,18.4 13.8,18.4 14.5,19.1 15.2,19.1 15.5,19.4 15.5,20 14.9,20.6 v14.9,21.1
N$25
  Top 0.2: X1.L3 15.29,37.28 15,37 15,35.1 18.5,31.6 18.5,21.4 18.2,21.1 R12.1
N$26
  Top 0.2: R13.1 5.85,32.85 8,35 8,37 5.52,39.48 X1.L1
N$27  (via drill 0.3)
  Top 0.2: U$5.P$2 9.35,17.75 8.9,18.2 v8.8,18.2 | R15.1 R13.2 7.55,24.65 v7.6,24.7
  Bottom 0.2: v7.6,24.7 7.6,19.4 v8.8,18.2
N$28
  Top 0.2: U$5.P$6 9.05,15.75 8.9,15.6 C25.1 C24.1
N$29
  Top 0.2: U$5.P$24 10.18,18.92 9,20.1 R16.1
N$32
  Top 0.2: J4.3 43,37.85 R14.2 R8.2
NRST  (via drill 0.3)
  Top 0.2: U1.14 31.6,13 29.6,11 v29.6,6.6
  Bottom 0.2: U$4.10 19.97,4.2 21.9,4.2 22.1,4 22.7,4 23.3,4.6 28.5,4.6 29.6,5.7 v29.6,6.6
RX_N  (via drill 0.3)
  Top 0.2: U$5.P$22 11.45,20.05 v11.3,20.2 RN1.2
  Bottom 0.2: X1.6 10.1,26.7 10.1,20.7 9.9,20.5 9.9,19.9 10.2,19.6 10.8,19.6 11.3,20.1 v11.3,20.2
RX_P  (via drill 0.3)
  Top 0.2: U$5.P$23 10.95,19.65 10.5,20.1 v10.5,20.2 10.4,20.3 RN1.1
  Bottom 0.2: X1.3 13.15,29.75 10.6,27.2 10.6,26.7 10.5,26.6 v10.5,20.2
SD_LED
  Top 0.2: U1.29 33.55,21.05 33.3,21.3 R6.2
SDIO_CK  (via drill 0.3)
  Top 0.2: U1.80 25.05,5.65 26,6.6 v26,12.8 | U2.14 30.8,24.5 29.7,23.4 v29.4,23.4
  Bottom 0.2: v29.4,23.4 29.6,23.2 29.6,16.7 26,13.1 v26,12.8
SDIO_CMD  (via drill 0.3)
  Top 0.2: U2.11 29.6,24.4 v29.4,24.2 | v26.6,12.1 26.55,12.05 U1.83
  Bottom 0.2: v29.4,24.2 29.7,24.2 30,23.9 30,16.5 26.6,13.1 v26.6,12.1
SDIO_D0  (via drill 0.3)
  Top 0.2: U2.15 31.2,24.3 29.7,22.8 v27.6,22.8 | v23.6,12.8 22.3,11.5 U1.65
  Bottom 0.2: v23.6,12.8 23.6,13.1 28,17.5 28,21.5 27.6,21.9 v27.6,22.8
SDIO_D1  (via drill 0.3)
  Top 0.2: U2.16 31.6,24.1 29.7,22.2 v28.2,22.2 | v24.2,12.2 23,11 U1.66
  Bottom 0.2: v24.2,12.2 24.2,13.1 28.4,17.3 28.4,22 v28.2,22.2
SDIO_D2  (via drill 0.3)
  Top 0.2: v24.8,12.8 24.8,6.6 24.05,5.85 U1.78 | U2.9 28.8,25.7 28.1,25 v28.1,24.3
  Bottom 0.2: v24.8,12.8 24.8,13.1 28.8,17.1 28.8,22.5 28.1,23.2 v28.1,24.3
SDIO_D3  (via drill 0.3)
  Top 0.2: U2.10 29.2,25.2 v28.8,24.8 | v25.4,12.2 25.4,6.6 24.55,5.75 U1.79
  Bottom 0.2: v25.4,12.2 25.4,13.1 29.2,16.9 29.2,22.7 28.8,23.1 v28.8,24.8
TX_N  (via drill 0.3)
  Top 0.2: U$5.P$20 12.45,19.65 12.9,20.1 v12.9,20.2 12.99,20.3 RN1.4
  Bottom 0.2: X1.2 14.68,23.77 12.9,22 v12.9,20.2
TX_P  (via drill 0.3)
  Top 0.2: U$5.P$21 11.95,20.05 v12.1,20.2 RN1.3
  Bottom 0.2: X1.1 15.94,27.04 15.1,26.2 15.1,23.6 13.5,22 13.5,19.9 13.2,19.6 12.6,19.6 12.1,20.1 v12.1,20.2
UART_RX  (via drill 0.3)
  Top 0.2: U1.93 31.55,7.85 34.6,10.9 v34.6,11.9
  Bottom 0.2: v34.6,11.9 37.3,14.6 37.3,21 41.33,25.02 X5.4
UART_TX  (via drill 0.3)
  Top 0.2: U1.92 31.05,7.95 34,10.9 v34,11.3
  Bottom 0.2: v34,11.3 34.9,11.3 35.2,11.6 35.2,11.9 37.7,14.4 37.7,20.8 42.58,25.68 X5.3
USB_DM  (via drill 0.3)
  Top 0.2: U1.70 23.4,9 v23.6,9.2 | R11.1 43.7,35.35 v43.7,34.7
  Bottom 0.2: v23.6,9.2 24.5,9.2 24.7,9.4 29.6,9.4 36,15.8 36,24.7 43.7,32.4 v43.7,34.7
USB_DP  (via drill 0.3)
  Top 0.2: U1.71 23.8,8.5 24.2,8.9 v24.2,9.8 | R14.1 42.9,35.25 v42.9,34.7
  Bottom 0.2: v24.2,9.8 29.4,9.8 35.6,16 35.6,24.9 43.3,32.6 43.3,34.2 42.9,34.6 v42.9,34.7
USB_VBUS
  Top 0.4: J4.1 44.3,38.8
  Top 0.6: D1.A 45.2,37.9 44.3,38.8
VCAP_1
  Top 0.2: U1.49 23.55,21.35 24,21.8 C5.1
VCAP_2
  Top 0.2: U1.73 20.5,7.5 19.9,8.1 C4.1

### Text on the board
Document: SD
200bmp: ETH module / v1.0 (2015/02)